# EAGLE schematic plaque2 (EAGLE 7.2.0)
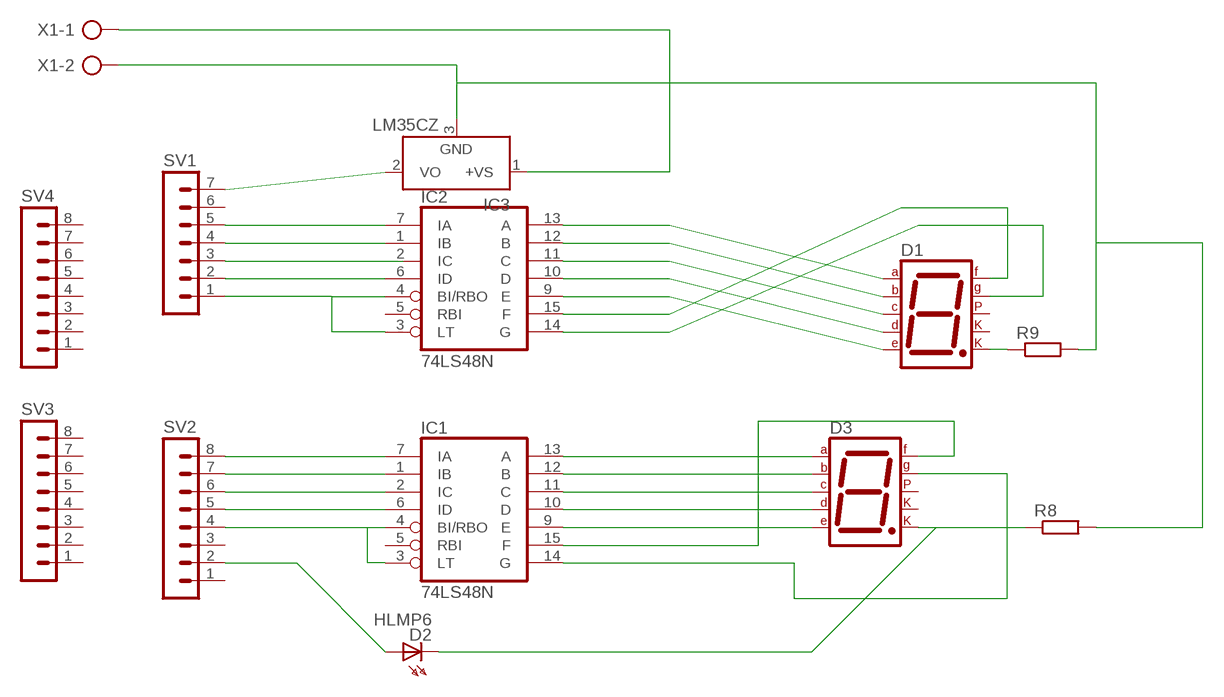
[diagram p0: schematic, sheet 1]

## Parts
D1  7SEG-CK  [7SEG-13]
D2  HLMP6  [HLMP6]
D3  7SEG-CK  [7SEG-13]
IC1  74LS48N  [DIL16]
IC2  74LS48N  [DIL16]
IC3  LM35CZ  [TO92]
R8  R-EU_0204/7  [0204/7]
R9  R-EU_0204/7  [0204/7]
SV1  MA07-1  [MA07-1]
SV2  MA08-1  [MA08-1]
SV3  MA08-1  [MA08-1]
SV4  MA08-1  [MA08-1]
X1  AK500/2-H  [AK500/2-H]

## Nets
N$1: IC3.2(VO) SV1.7
N$2: IC2.7(IA) SV1.5
N$3: IC2.1(IB) SV1.4
N$4: SV1.3
N$5: IC2.6(ID) SV1.2
N$6: IC2.3(LT) IC2.4(BI/RBO) SV1.1
N$7: D1.7(A) IC2.13(A)
N$8: D1.6(B) IC2.12(B)
N$9: D1.4(C) IC2.11(C)
N$10: D1.2(D) IC2.10(D)
N$11: D1.1(E) IC2.9(E)
N$12: D1.9(F) IC2.15(F)
N$13: D1.10(G) IC2.14(G)
N$14: IC1.7(IA) SV2.8
N$15: IC1.1(IB) SV2.7
N$16: IC1.2(IC) SV2.6
N$17: IC1.6(ID) SV2.5
N$18: IC1.3(LT) IC1.4(BI/RBO) SV2.4
N$19: D3.7(A) IC1.13(A)
N$20: D3.6(B) IC1.12(B)
N$21: D3.4(C) IC1.11(C)
N$22: D3.2(D) IC1.10(D)
N$23: D3.1(E) IC1.9(E)
N$24: D3.9(F) IC1.15(F)
N$26: IC3.1(+VS) X1.1
N$27: D3.10(G) IC1.14(G)
N$28: D2.A SV2.2
N$29: IC3.3(GND) R8.2 R9.2 X1.2
N$34: D1.8(CK2) R9.1
N$35: D2.K D3.8(CK2) R8.1
Unconnected: D1.3(CK1) D1.5(DP) D3.3(CK1) D3.5(DP) IC1.5(RBI) IC2.2(IC) IC2.5(RBI) SV1.6 SV2.1 SV2.3 SV3.1 SV3.2 SV3.3 SV3.4 SV3.5 SV3.6 SV3.7 SV3.8 SV4.1 SV4.2 SV4.3 SV4.4 SV4.5 SV4.6 SV4.7 SV4.8

## Power pins joined to a net without a drawn wire
GND: IC1.8(GND) IC2.8(GND)
VCC: IC1.16(VCC) IC2.16(VCC)

## Library data of the parts
D1 D3 = special:7SEG-CK: 7-segment DISPLAY single cathode, 13 mm
D2 = display-hp:HLMP6: LED 2mm horizontal; MF: AGILENT TECHNOLOGIES; MPN: HLMP-6500; OC_FARNELL: 1652490; OC_NEWARK: 40K0088
IC1 IC2 = 74xx-eu:74*48: BCD to seven segment DECODER/DRIVER
IC3 = lm35:LM35: Single-Supply Centigrade Temperature Sensor Vout = (10mV/°C x Temp °C) +5mmmV Source: http://www.national.com/ds/LM/LM35.pdf
R8 R9 = rcl:R-EU_: RESISTOR, European symbol
SV1 = con-lstb:MA07-1: PIN HEADER; OC_FARNELL: unknown; OC_NEWARK: unknown
SV2-SV4 = con-lstb:MA08-1: PIN HEADER; OC_FARNELL: unknown; OC_NEWARK: unknown
X1 = con-ptr500:AK500/2-H: CONNECTOR Aug. 2004 / PTR Meßtechnik: Die Bezeichnung der Serie AK505 wurde geändert. Es handelt sich hierbei um AK500 in horizontaler Ausführung.; OC_FARNELL: unknown; OC_NEWARK: unknown